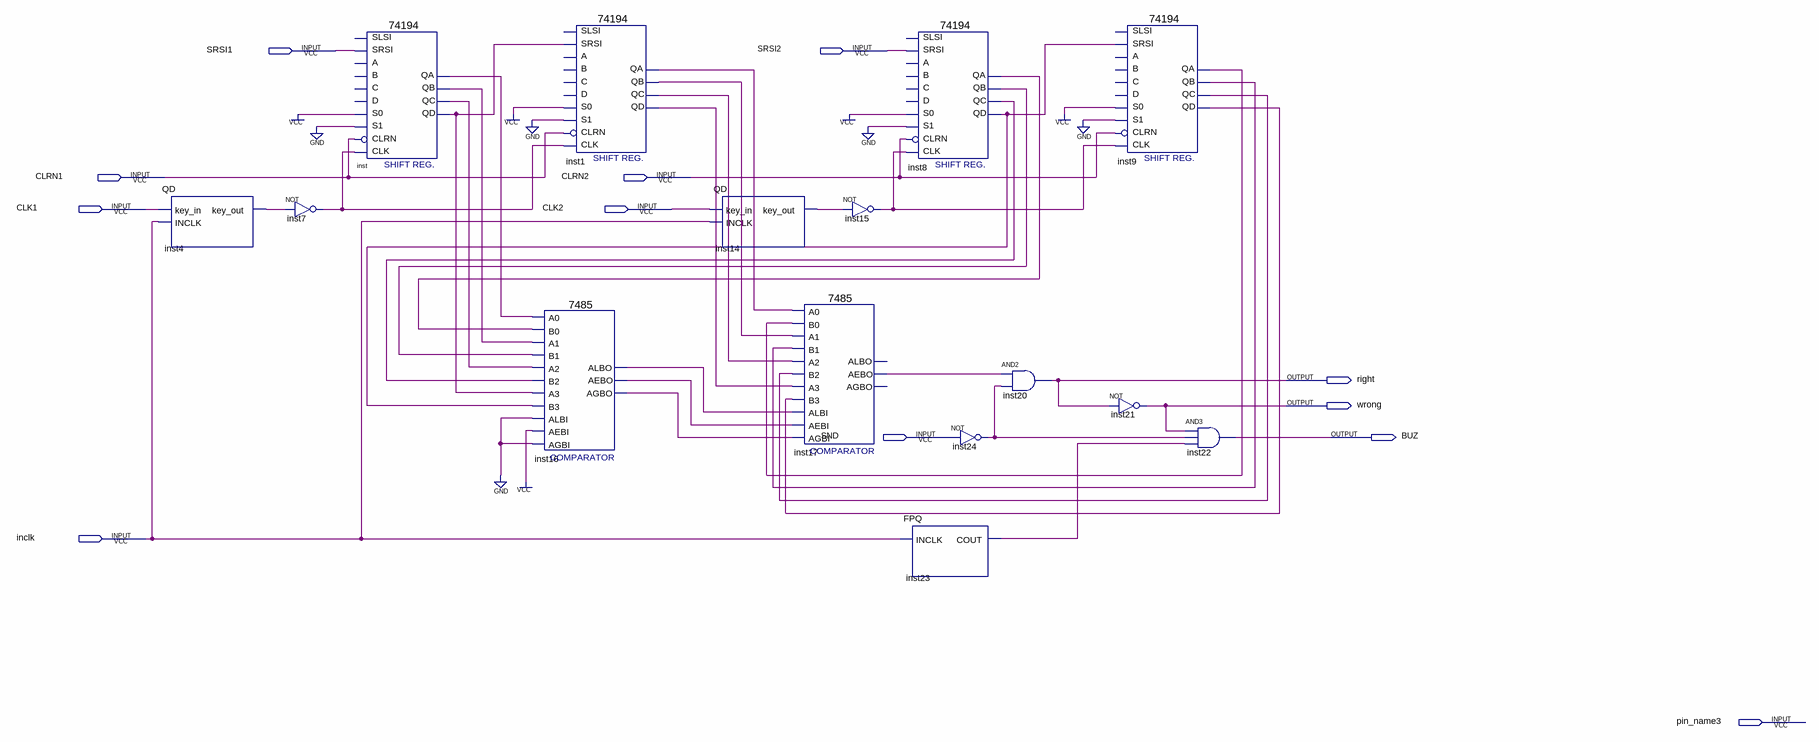
[diagram p0: schematic sheet]
// Quartus schematic TNBECL.bdf as structural Verilog: 15 symbols, 12 pins
module TNBECL (
  input  SRSI1,
  input  SRSI2,
  input  CLRN1,
  input  CLRN2,
  input  CLK1,
  input  CLK2,
  input  SND,
  input  inclk,
  input  pin_name3,
  output right,
  output wrong,
  output BUZ
);

  wire inst1_qa, inst1_qb, inst1_qc, inst1_qd, inst4_key_out, inst7_out, inst8_qa, inst8_qb, inst8_qc,
       inst8_qd, inst9_qa, inst9_qb, inst9_qc, inst9_qd, inst14_key_out, inst15_out, inst16_aebo,
       inst16_agbo, inst16_albo, inst17_aebo, inst23_cout, inst24_out, inst_qa, inst_qb, inst_qc, inst_qd;

  QD inst4 (.key_in(CLK1), .INCLK(inclk), .key_out(inst4_key_out));
  not inst7 (inst7_out, inst4_key_out);
  \74194  inst (
    .SRSI(SRSI1), .CLK(inst7_out), .CLRN(CLRN1), .S1(1'b0), .S0(1'b1), .QA(inst_qa), .QB(inst_qb),
    .QC(inst_qc), .QD(inst_qd));  // open: SLSI, B, C, D, A
  \7485  inst16 (
    .A3(inst_qd), .B2(inst8_qc), .A2(inst_qc), .AEBI(1'b1), .AGBI(1'b0), .ALBI(1'b0), .A0(inst_qa),
    .B0(inst8_qa), .B3(inst8_qd), .A1(inst_qb), .B1(inst8_qb), .ALBO(inst16_albo), .AGBO(inst16_agbo),
    .AEBO(inst16_aebo));
  \74194  inst1 (
    .SRSI(inst_qd), .CLK(inst7_out), .CLRN(CLRN1), .S1(1'b0), .S0(1'b1), .QA(inst1_qa), .QB(inst1_qb),
    .QC(inst1_qc), .QD(inst1_qd));  // open: SLSI, B, C, D, A
  QD inst14 (.key_in(CLK2), .INCLK(inclk), .key_out(inst14_key_out));
  \7485  inst17 (
    .A3(inst1_qd), .B2(inst9_qc), .A2(inst1_qc), .AEBI(inst16_aebo), .AGBI(inst16_agbo), .ALBI(inst16_albo),
    .A0(inst1_qa), .B0(inst9_qa), .B3(inst9_qd), .A1(inst1_qb), .B1(inst9_qb), .AEBO(inst17_aebo));  // open: ALBO, AGBO
  not inst15 (inst15_out, inst14_key_out);
  \74194  inst8 (
    .SRSI(SRSI2), .CLK(inst15_out), .CLRN(CLRN2), .S1(1'b0), .S0(1'b1), .QA(inst8_qa), .QB(inst8_qb),
    .QC(inst8_qc), .QD(inst8_qd));  // open: SLSI, B, C, D, A
  FPQ inst23 (.INCLK(inclk), .COUT(inst23_cout));
  not inst24 (inst24_out, SND);
  and inst20 (right, inst17_aebo, inst24_out);
  not inst21 (wrong, right);
  \74194  inst9 (
    .SRSI(inst8_qd), .CLK(inst15_out), .CLRN(CLRN2), .S1(1'b0), .S0(1'b1), .QA(inst9_qa), .QB(inst9_qb),
    .QC(inst9_qc), .QD(inst9_qd));  // open: SLSI, B, C, D, A
  and inst22 (BUZ, wrong, inst24_out, inst23_cout);
endmodule
